# Altium schematic sheet Emisores U.SchDoc
size A4
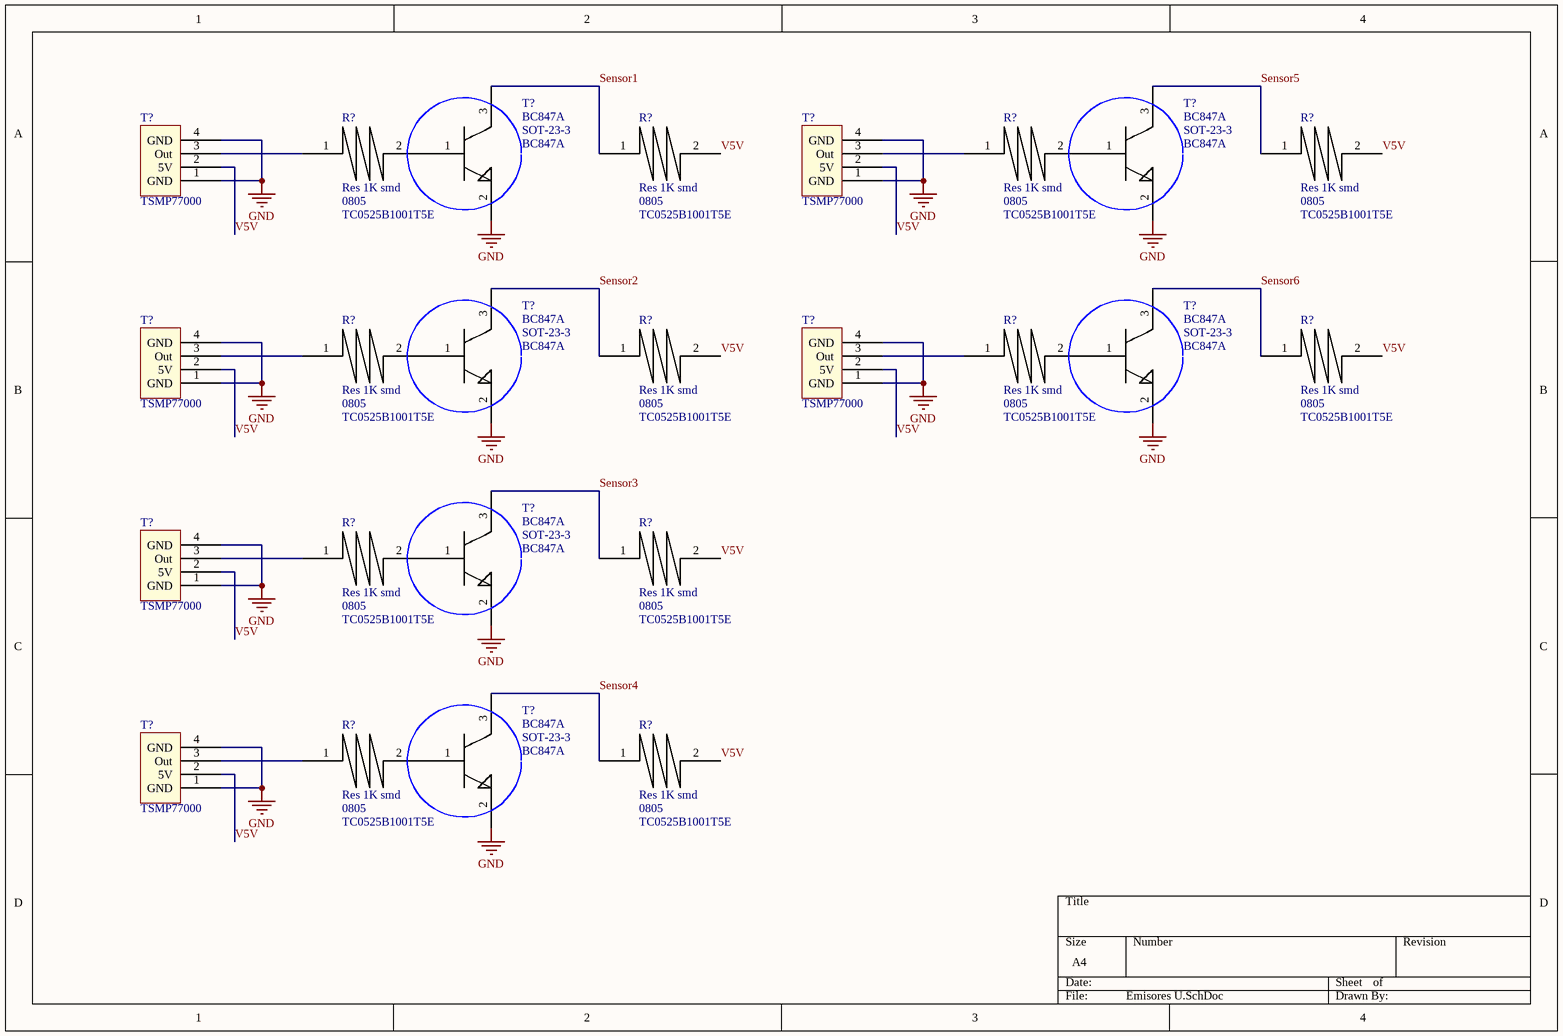
[diagram p0: Emisores U.SchDoc]

## Parts
(Parts that share a designator on the sheet are numbered #1, #2 ... from top to bottom, then left to right.)
R?#1  Res 1K smd  Package: 0805  MFR.Part #: TC0525B1001T5E  [RES 1K]
R?#2  Res 1K smd  Package: 0805  MFR.Part #: TC0525B1001T5E  [RES 1K]
R?#3  Res 1K smd  Package: 0805  MFR.Part #: TC0525B1001T5E  [RES 1K]
R?#4  Res 1K smd  Package: 0805  MFR.Part #: TC0525B1001T5E  [RES 1K]
R?#5  Res 1K smd  Package: 0805  MFR.Part #: TC0525B1001T5E  [RES 1K]
R?#6  Res 1K smd  Package: 0805  MFR.Part #: TC0525B1001T5E  [RES 1K]
R?#7  Res 1K smd  Package: 0805  MFR.Part #: TC0525B1001T5E  [RES 1K]
R?#8  Res 1K smd  Package: 0805  MFR.Part #: TC0525B1001T5E  [RES 1K]
R?#9  Res 1K smd  Package: 0805  MFR.Part #: TC0525B1001T5E  [RES 1K]
R?#10  Res 1K smd  Package: 0805  MFR.Part #: TC0525B1001T5E  [RES 1K]
R?#11  Res 1K smd  Package: 0805  MFR.Part #: TC0525B1001T5E  [RES 1K]
R?#12  Res 1K smd  Package: 0805  MFR.Part #: TC0525B1001T5E  [RES 1K]
T?#1  BC847A  Package: SOT-23-3  [BC847A]
T?#2  BC847A  Package: SOT-23-3  [BC847A]
T?#3  TSMP77000  [TSMP77000]
T?#4  TSMP77000  [TSMP77000]
T?#5  BC847A  Package: SOT-23-3  [BC847A]
T?#6  BC847A  Package: SOT-23-3  [BC847A]
T?#7  TSMP77000  [TSMP77000]
T?#8  TSMP77000  [TSMP77000]
T?#9  BC847A  Package: SOT-23-3  [BC847A]
T?#10  TSMP77000  [TSMP77000]
T?#11  BC847A  Package: SOT-23-3  [BC847A]
T?#12  TSMP77000  [TSMP77000]

## Nets
GND: T?#1.2 T?#2.2 T?#3.1(GND) T?#3.4(GND) T?#4.1(GND) T?#4.4(GND) T?#5.2 T?#6.2 T?#7.1(GND) T?#7.4(GND) T?#8.1(GND) T?#8.4(GND) T?#9.2 T?#10.1(GND) T?#10.4(GND) T?#11.2 T?#12.1(GND) T?#12.4(GND)
Sensor1: R?#2.1 T?#1.3
Sensor2: R?#6.1 T?#5.3
Sensor3: R?#10.1 T?#9.3
Sensor4: R?#12.1 T?#11.3
Sensor5: R?#4.1 T?#2.3
Sensor6: R?#8.1 T?#6.3
V5V: R?#2.2 R?#4.2 R?#6.2 R?#8.2 R?#10.2 R?#12.2 T?#3.2(5V) T?#4.2(5V) T?#7.2(5V) T?#8.2(5V) T?#10.2(5V) T?#12.2(5V)
NetR?#1_1: R?#1.1 T?#3.3(Out)
NetR?#1_2: R?#1.2 T?#1.1
NetR?#3_1: R?#3.1 T?#4.3(Out)
NetR?#3_2: R?#3.2 T?#2.1
NetR?#5_1: R?#5.1 T?#7.3(Out)
NetR?#5_2: R?#5.2 T?#5.1
NetR?#7_1: R?#7.1 T?#8.3(Out)
NetR?#7_2: R?#7.2 T?#6.1
NetR?#9_1: R?#9.1 T?#10.3(Out)
NetR?#9_2: R?#9.2 T?#9.1
NetR?#11_1: R?#11.1 T?#12.3(Out)
NetR?#11_2: R?#11.2 T?#11.1

## Library data of the parts
T?#1 T?#2 T?#5 T?#6 T?#9 T?#11 = BC847A: MFR.Part #: BC847A
T?#3 T?#4 T?#7 T?#8 T?#10 T?#12 = TSMP77000: # Parte: TSMP77000; Link: https://www.mouser.mx/datasheet/2/427/VISH_S_A0012397601_1-2572564.pdf